# Altium project DesignIII -AlimSTM.PrjPcb
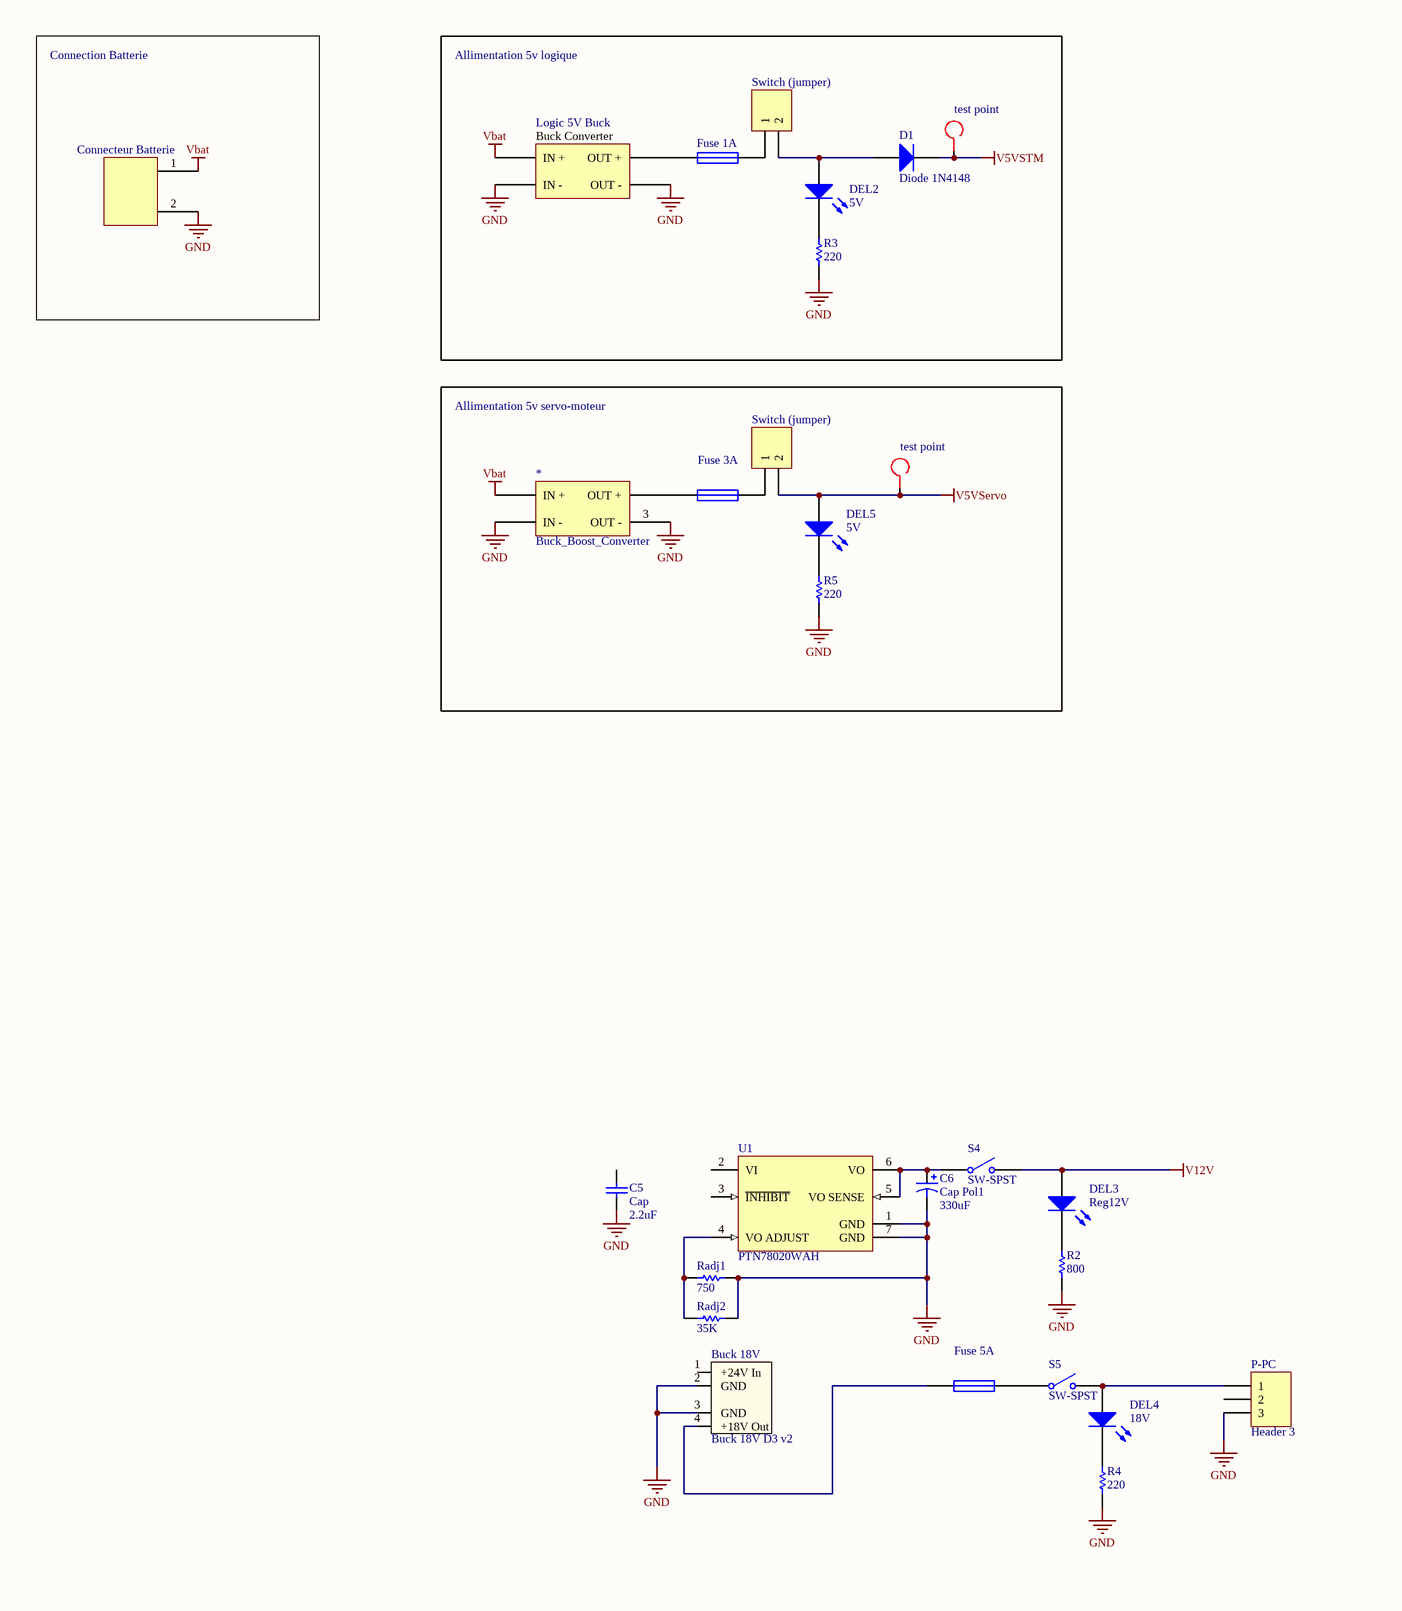
[diagram p0: Alim.SchDoc, left]
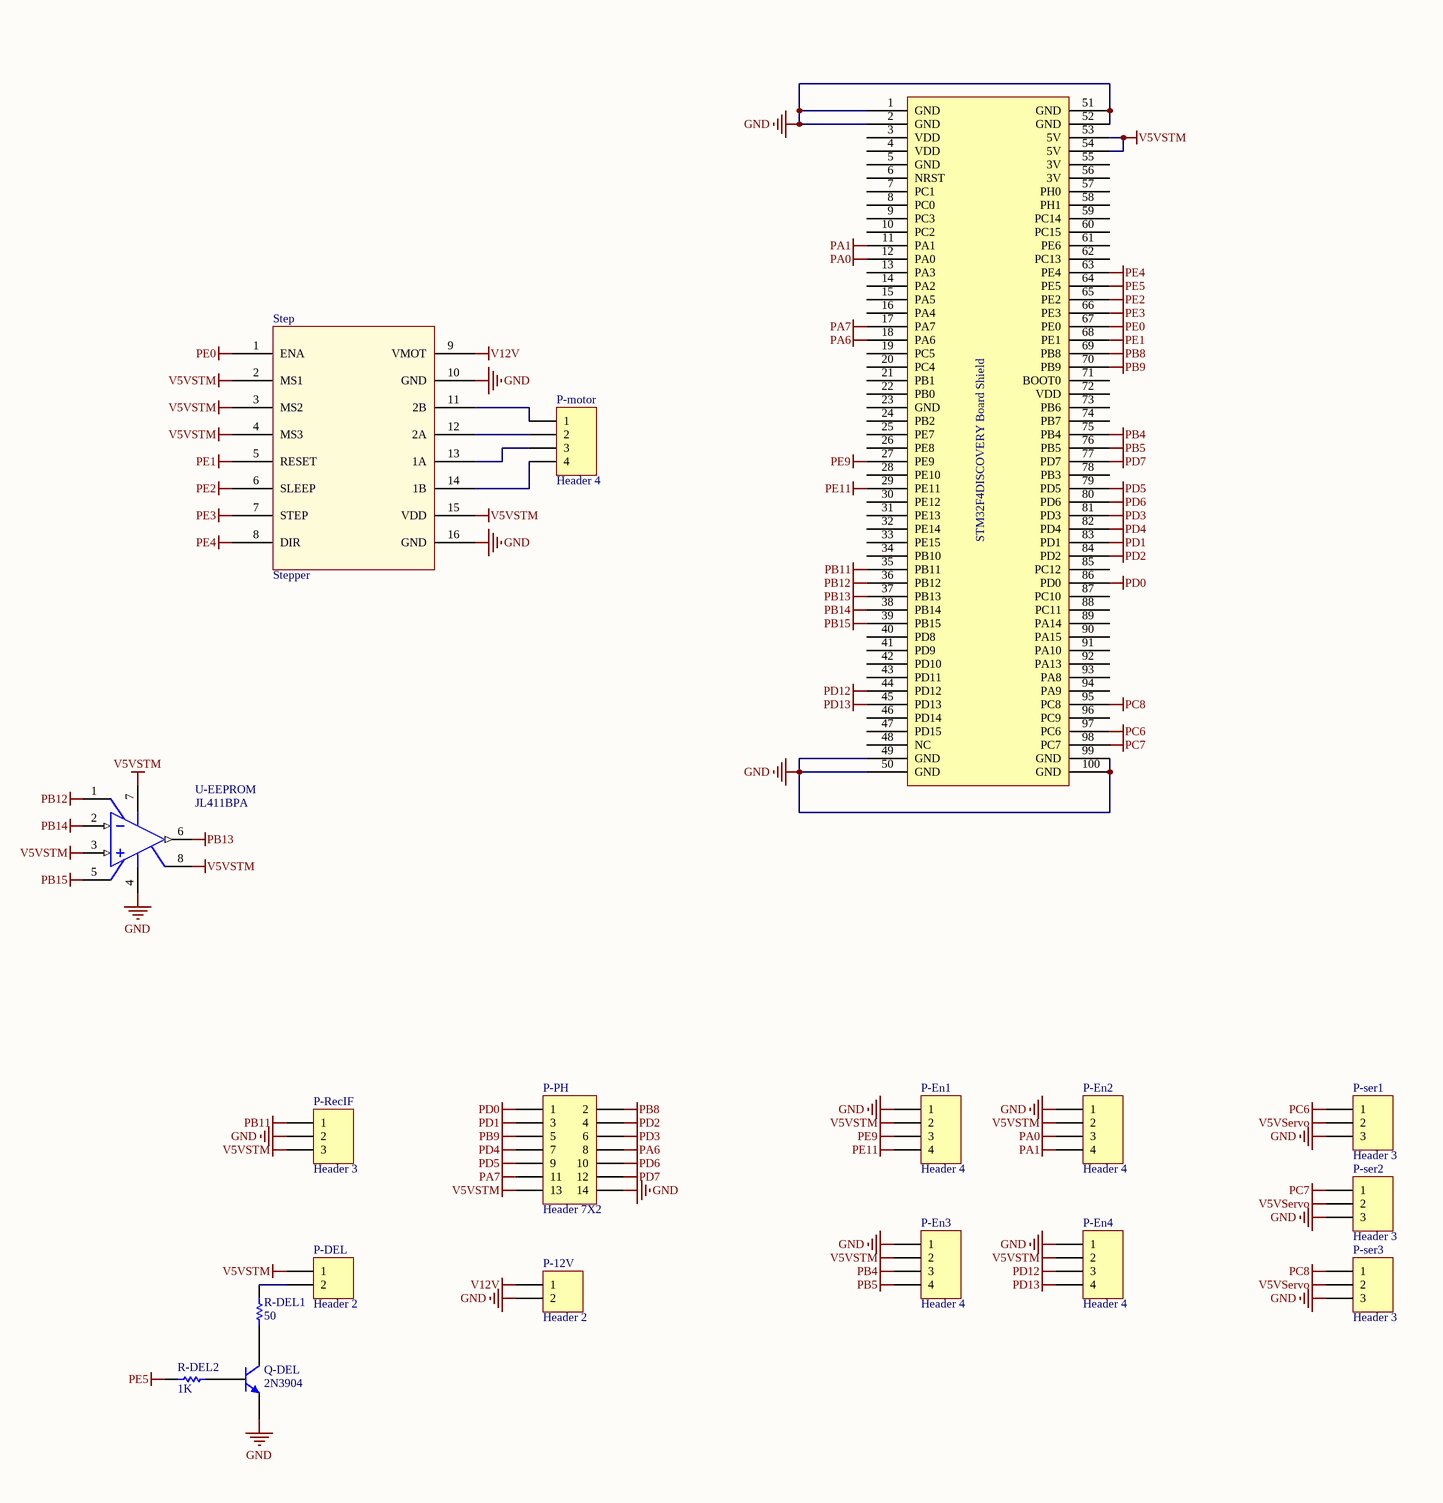
[diagram p1: Alim.SchDoc, right]
1 sheet, 46 parts. Net scope: global (net labels, ports and power ports of the same name join across sheets).
Board file: PCB1.PcbDoc

## Sheet Alim.SchDoc
size A2

### Parts
(Parts that share a designator on the sheet are numbered #1, #2 ... from top to bottom, then left to right.)
*  Buck_Boost_Converter  [Buck_Boost_Converter]
B1  Logic 5V Buck  [Buck_Converter]
Buck_18V  Buck 18V D3 v2  [Buck 18V D3]
C5  Cap  value 2.2uF  [RAD-0.3]
C6  Cap Pol1  value 330uF  [RB7.6-15]
CON1  Connecteur Batterie  [BAT]
D1  Diode 1N4148  [DO-35]
DEL2  5V  [LED-1]
DEL3  Reg12V  [LED-1]
DEL4  18V  [LED-1]
DEL5  5V  [LED-1]
Fuse_1A  Fuse 5A  [AXIAL-0.9]  (value not drawn)
Fuse_3A  Fuse 8A  [AXIAL-0.9]  (value not drawn)
Fuse_5A  Fuse 8A  [AXIAL-0.9]  (value not drawn)
P1  Switch (jumper)  [HDR1X2]
P2  Switch (jumper)  [HDR1X2]
P-12V  Header 2  [HDR1X2]
P-DEL  Header 2  [HDR1X2]
P-En1  Header 4  [HDR1X4]
P-En2  Header 4  [HDR1X4]
P-En3  Header 4  [HDR1X4]
P-En4  Header 4  [HDR1X4]
P-motor  Header 4  [HDR1X4]
P-PC  Header 3  [HDR1X3]
P-PH  Header 7X2  [HDR2X7]
P-RecIF  Header 3  [HDR1X3]
P-ser1  Header 3  [HDR1X3]
P-ser2  Header 3  [HDR1X3]
P-ser3  Header 3  [HDR1X3]
Q-DEL  2N3904  [TO-92A]
R2  value 800  [AXIAL-0.3]  (hidden comment: Res1)
R3  value 220  [AXIAL-0.3]  (hidden comment: Res1)
R4  value 220  [AXIAL-0.3]  (hidden comment: Res1)
R5  value 220  [AXIAL-0.3]  (hidden comment: Res1)
R-DEL1  value 50  [AXIAL-0.3]  (hidden comment: Res1)
R-DEL2  value 1K  [AXIAL-0.3]  (hidden comment: Res1)
Radj1  value 750  [AXIAL-0.3]  (hidden comment: Res1)
Radj2  value 35K  [AXIAL-0.3]  (hidden comment: Res1)
S4  SW-SPST  [SPST-2]
S5  SW-SPST  [SPST-2]
Step  Stepper  [stepper]
TP1  test point  [Test_Point]
TP2  test point  [Test_Point]
U1#1  STM32F4  [STM32F4DISCOVERY Board Shield]  (value not drawn)
U1#2  PTN78020WAH  [TI-EUK7_V]
U-EEPROM  JL411BPA  [J08A]

### Blocks framed on the sheet
Connection Batterie: CON1
Allimentation 5v logique: B1 D1 DEL2 Fuse_1A P1 R3 TP1
Allimentation 5v servo-moteur: * DEL5 Fuse_3A P2 R5 TP2

### Nets
GND: *.1(IN_-) *.3(OUT_-) B1.1(IN_-) B1.3(OUT_-) Buck_18V.2(GND) Buck_18V.3(GND) C5.1 C6.2 CON1.2 P-12V.2 P-En1.1 P-En2.1 P-En3.1 P-En4.1 P-PC.3 P-PH.14 P-RecIF.2 P-ser1.3 P-ser2.3 P-ser3.3 Q-DEL.1(E) R2.2 R3.1 R4.1 R5.2 Radj1.2 Radj2.2 Step.10(GND) Step.16(GND) U1#1.1(GND) U1#1.2(GND) U1#1.49(GND) U1#1.50(GND) U1#1.51(GND) U1#1.52(GND) U1#1.99(GND) U1#1.100(GND) U1#2.1(GND) U1#2.7(GND) U-EEPROM.4(V-)
PA0: P-En2.3 U1#1.12(PA0)
PA1: P-En2.4 U1#1.11(PA1)
PA6: P-PH.8 U1#1.18(PA6)
PA7: P-PH.11 U1#1.17(PA7)
PB4: P-En3.3 U1#1.75(PB4)
PB5: P-En3.4 U1#1.76(PB5)
PB8: P-PH.2 U1#1.69(PB8)
PB9: P-PH.5 U1#1.70(PB9)
PB11: P-RecIF.1 U1#1.35(PB11)
PB12: U1#1.36(PB12) U-EEPROM.1(BAL)
PB13: U1#1.37(PB13) U-EEPROM.6(OUT)
PB14: U1#1.38(PB14) U-EEPROM.2(IN-)
PB15: U1#1.39(PB15) U-EEPROM.5(BAL)
PC6: P-ser1.1 U1#1.97(PC6)
PC7: P-ser2.1 U1#1.98(PC7)
PC8: P-ser3.1 U1#1.95(PC8)
PD0: P-PH.1 U1#1.86(PD0)
PD1: P-PH.3 U1#1.83(PD1)
PD2: P-PH.4 U1#1.84(PD2)
PD3: P-PH.6 U1#1.81(PD3)
PD4: P-PH.7 U1#1.82(PD4)
PD5: P-PH.9 U1#1.79(PD5)
PD6: P-PH.10 U1#1.80(PD6)
PD7: P-PH.12 U1#1.77(PD7)
PD12: P-En4.3 U1#1.44(PD12)
PD13: P-En4.4 U1#1.45(PD13)
PE0: Step.1(ENA) U1#1.67(PE0)
PE1: Step.5(RESET) U1#1.68(PE1)
PE2: Step.6(SLEEP) U1#1.65(PE2)
PE3: Step.7(STEP) U1#1.66(PE3)
PE4: Step.8(DIR) U1#1.63(PE4)
PE5: R-DEL2.2 U1#1.64(PE5)
PE9: P-En1.3 U1#1.27(PE9)
PE11: P-En1.4 U1#1.29(PE11)
V5VServo: DEL5.1(A) P2.2 P-ser1.2 P-ser2.2 P-ser3.2 TP2.0(test)
V5VSTM: D1.2(K) P-DEL.1 P-En1.2 P-En2.2 P-En3.2 P-En4.2 P-PH.13 P-RecIF.3 Step.2(MS1) Step.3(MS2) Step.4(MS3) Step.15(VDD) TP1.0(test) U1#1.53(5V) U1#1.54(5V) U-EEPROM.3(IN+) U-EEPROM.7(V+) U-EEPROM.8(NC)
V12V: DEL3.1(A) P-12V.1 S4.2(NO) Step.9(VMOT)
Vbat: *.0(IN_+) B1.0(IN_+) CON1.1
Net*_2: *.2(OUT_+) Fuse_3A.1
NetB1_2: B1.2(OUT_+) Fuse_1A.1
NetBuck_18V_4: Buck_18V.4(+18V_Out) Fuse_5A.1
NetC6_1: C6.1 S4.1(COMMON) U1#2.5(VO_SENSE) U1#2.6(VO)
NetD1_1: D1.1(A) DEL2.1(A) P1.2
NetDEL2_2: DEL2.2(K) R3.2
NetDEL3_2: DEL3.2(K) R2.1
NetDEL4_1: DEL4.1(A) P-PC.1 S5.2(NO)
NetDEL4_2: DEL4.2(K) R4.2
NetDEL5_2: DEL5.2(K) R5.1
NetFuse_1A_2: Fuse_1A.2 P1.1
NetFuse_3A_2: Fuse_3A.2 P2.1
NetFuse_5A_2: Fuse_5A.2 S5.1(COMMON)
NetP-DEL_2: P-DEL.2 R-DEL1.2
NetP-motor_1: P-motor.1 Step.11(2B)
NetP-motor_2: P-motor.2 Step.12(2A)
NetP-motor_3: P-motor.3 Step.13(1A)
NetP-motor_4: P-motor.4 Step.14(1B)
NetQ-DEL_2: Q-DEL.2(B) R-DEL2.1
NetQ-DEL_3: Q-DEL.3(C) R-DEL1.1
NetRadj1_1: Radj1.1 Radj2.1 U1#2.4(VO_ADJUST)

Not connected (* = marked no-connect by the designer): Buck_18V 1(+24V_In); C5 2; P-PC 2; U1#1 3(VDD) 4(VDD) 5(GND) 6(NRST) 7(PC1) 8(PC0) 9(PC3) 10(PC2) 13(PA3) 14(PA2) 15(PA5) 16(PA4) 19(PC5) 20(PC4) 21(PB1) 22(PB0) 23(GND) 24(PB2) 25(PE7) 26(PE8) 28(PE10) 30(PE12) 31(PE13) 32(PE14) 33(PE15) 34(PB10) 40(PD8) 41(PD9) 42(PD10) 43(PD11) 46(PD14) 47(PD15) 48(NC) 55(3V) 56(3V) 57(PH0) 58(PH1) 59(PC14) 60(PC15) 61(PE6) 62(PC13) 71(BOOT0) 72(VDD) 73(PB6) 74(PB7) 78(PB3) 85(PC12) 87(PC10) 88(PC11) 89(PA14) 90(PA15) 91(PA10) 92(PA13) 93(PA8) 94(PA9) 96(PC9); U1#2 2(VI) 3(~{INHIBIT})

### Notes on the sheet
- (in symbol Buck_Converter) Buck Converter

### Library data of the parts
* = Buck_Boost_Converter: DC-DC Auto Boost Buck step Up step down Converter Module Solar Voltage LM2577
B1 = Buck_Converter: DC-DC LM2596 power Supply Buck Converter step-down module
C5 = Cap: Capacitor; Published: 8-Jun-2000; LatestRevisionDate: 17-Jul-2002; LatestRevisionNote: Re-released for DXP Platform.; PackageReference: RAD-0.3; Publisher: Altium Limited; PackageDescription: Radial Cap, Thru-Hole; 2 Leads; 0.3 in Pin Spacing
C6 = Cap Pol1: Polarized Capacitor (Radial); Published: 8-Jun-2000; LatestRevisionDate: 17-Jul-2002; LatestRevisionNote: Re-released for DXP Platform.; PackageReference: RB7.6-15; Publisher: Altium Limited; PackageDescription: Polarized Capacitor (Radial); 2 Leads
CON1 = BAT
D1 = Diode 1N4148: High Conductance Fast Diode; Published: 8-Jun-2000; LatestRevisionDate: 17-Jul-2002; LatestRevisionNote: Re-released for DXP Platform.; DatasheetVersion: 1997; PackageReference: DO-35; Publisher: Altium Limited; PackageDescription: Diode, Axial; Body 3.8 x 1.9 mm (LxDia. max), Lead Dia. 0.53 mm (max); Code_JEDEC: DO-204-AH; ComponentLink1Description: Manufacturer Link; ComponentLink1URL: http://www.fairchildsemi.com/; ComponentLink2Description: Datasheet; ComponentLink2URL: http://www.fairchildsemi.com/ds/1N%2F1N4148.pdf
DEL2-DEL5 = LED0: Typical INFRARED GaAs LED
Fuse_1A Fuse_3A Fuse_5A = Fuse 1: Fuse; Supplier Part Number 1: 36-4527-ND; Supplier 1: Service technique
P1 P2 P-12V P-DEL = Header 2: Header, 2-Pin; LatestRevisionDate: 17-Jul-2002; LatestRevisionNote: Re-released for DXP Platform.; Publisher: Altium Limited
P-En1-P-En4 P-motor = Header 4: Header, 4-Pin; LatestRevisionDate: 17-Jul-2002; LatestRevisionNote: Re-released for DXP Platform.; Publisher: Altium Limited
P-PC P-RecIF P-ser1-P-ser3 = Header 3: Header, 3-Pin; LatestRevisionDate: 17-Jul-2002; LatestRevisionNote: Re-released for DXP Platform.; Publisher: Altium Limited
P-PH = Header 7X2: Header, 7-Pin, Dual row; LatestRevisionDate: 17-Jul-2002; LatestRevisionNote: Re-released for DXP Platform.; Publisher: Altium Limited
Q-DEL = 2N3904: NPN General Purpose Amplifier; Published: 8-Jun-2000; LatestRevisionDate: 17-Jan-2003; LatestRevisionNote: PCB Footprint replaced; DatasheetVersion: 1997; PackageVersion: Sep-1998; PackageReference: TO-92A; Publisher: Altium Limited; PackageDescription: TO, Flat Index; 3 In-Line, Axial Leads; Body Dia. 4.5mm; Leads 0.51 x 0.48 mm (max); ComponentLink1Description: Manufacturer Link; ComponentLink1URL: http://www.fairchildsemi.com/; ComponentLink2Description: Datasheet; ComponentLink2URL: http://www.fairchildsemi.com/ds/2N%2F2N3904.pdf
R2-R5 R-DEL1 R-DEL2 Radj1 Radj2 = Res1: Resistor; Published: 8-Jun-2000; LatestRevisionDate: 17-Jul-2002; LatestRevisionNote: Re-released for DXP Platform.; PackageReference: AXIAL-0.3; Publisher: Altium Limited; PackageDescription: Axial Device, Thru-Hole; 2 Leads; 0.3 in Pin Spacing
S4 S5 = SW-SPST: Single-Pole, Single-Throw Switch; Published: 24-Mar-1999; LatestRevisionDate: 17-Jul-2002; LatestRevisionNote: Re-released for DXP Platform.; PackageReference: SPST-2; Publisher: Altium Limited; PackageDescription: Switch; 2 Leads
TP1 TP2 = Test_Point
U1#1 = STM32F4DISCOVERY Board Shield: Manufacturer: STMicroelectronics; Installation Type: Breakaway Board; Part Number: STM32F4DISCOVERY
U1#2 = PTN78020WAH: 6 A Wide-Input Voltage Adjustable Switching Regulator, -40 to 85 degC, 7-pin Module (EUK7), Pb-Free (RoHS); Manufacturer: Texas Instruments; Iout(Max)(A): 6; Regulated Outputs(#): 1; SubFamily: Non-Isolated POL; Vin(Max)(V): 36; Vin(Min)(V): 7; VO Adjustable: TRUE; Vout(Max)(V): 12.6; Vout(Min)(V): 2.5; DatasheetVersion: SLTS228C; PackageVersion: 4204986-2/C; PackageReference: EUK7; PackageDescription: 7-Pin Plastic Special Shape, Body 22.1 x 37.97 mm; Supplier 1: Digi-Key; Supplier Part Number 1: 296-20515-ND; Supplier 2: Farnell; Supplier Part Number 2: 1295945; Supplier 3: Newark; Supplier Part Number 3: 73J8281; Supplier 4: Mouser; Supplier Part Number 4: 595-PTN78020WAH; Eco-Plan: Pb-Free (RoHS); Mounting Technology: Through Hole; PartNumber: PTN78020WAH; ComponentLink1Description: Manufacturer URL; ComponentLink1URL: http://www.ti.com/; ComponentLink2Description: Datasheet; ComponentLink2URL: http://www.ti.com/general/docs/lit/getliterature.tsp?genericPartNumber=PTN78020W&fileType=pdf; ComponentLink3Description: Package Specification; ComponentLink3URL: http://www.ti.com/litv/pdf/mpds185; ComponentLink4Description: URL Link1; ComponentLink4URL: Samples URL:http://www.ti.com/product/ptn78020w#samples
U-EEPROM = JL411BPA: Low Offset, Low Drift JFET Input Operational Amplifier; Manufacturer: National Semiconductor; CompType: Amplifiers; PackageTopMarking: NS JM38510*/11904BPA*27014 Q*ZSSXXYYA; PowerWise: N; MilaeroCode: CXX; Published: 4-Dec-2008; DatasheetVersion: Oct-2005; PackageVersion: revM, Jul-2002; PackageReference: J08A; Publisher: Altium Limited; PackageDescription: Cerdip, .400 x .310in Body, 8 Lead, .300in Centers, .100in Pitch; PartNumber: JL411BPA; RoHS: N; PinCount: 8; ComponentLink1Description: LF411JAN Datasheet; ComponentLink1URL: http://www.national.com/ds/LF/LF411JAN.pdf; ComponentLink2Description: LF411 Web Page; ComponentLink2URL: http://www.national.com/pf/LF/LF411.html; ComponentLink3Description: J08A Package Page; ComponentLink3URL: http://www.national.com/packaging/folders/j08a.html